# EAGLE design SmartCup (EAGLE 6.5.0)
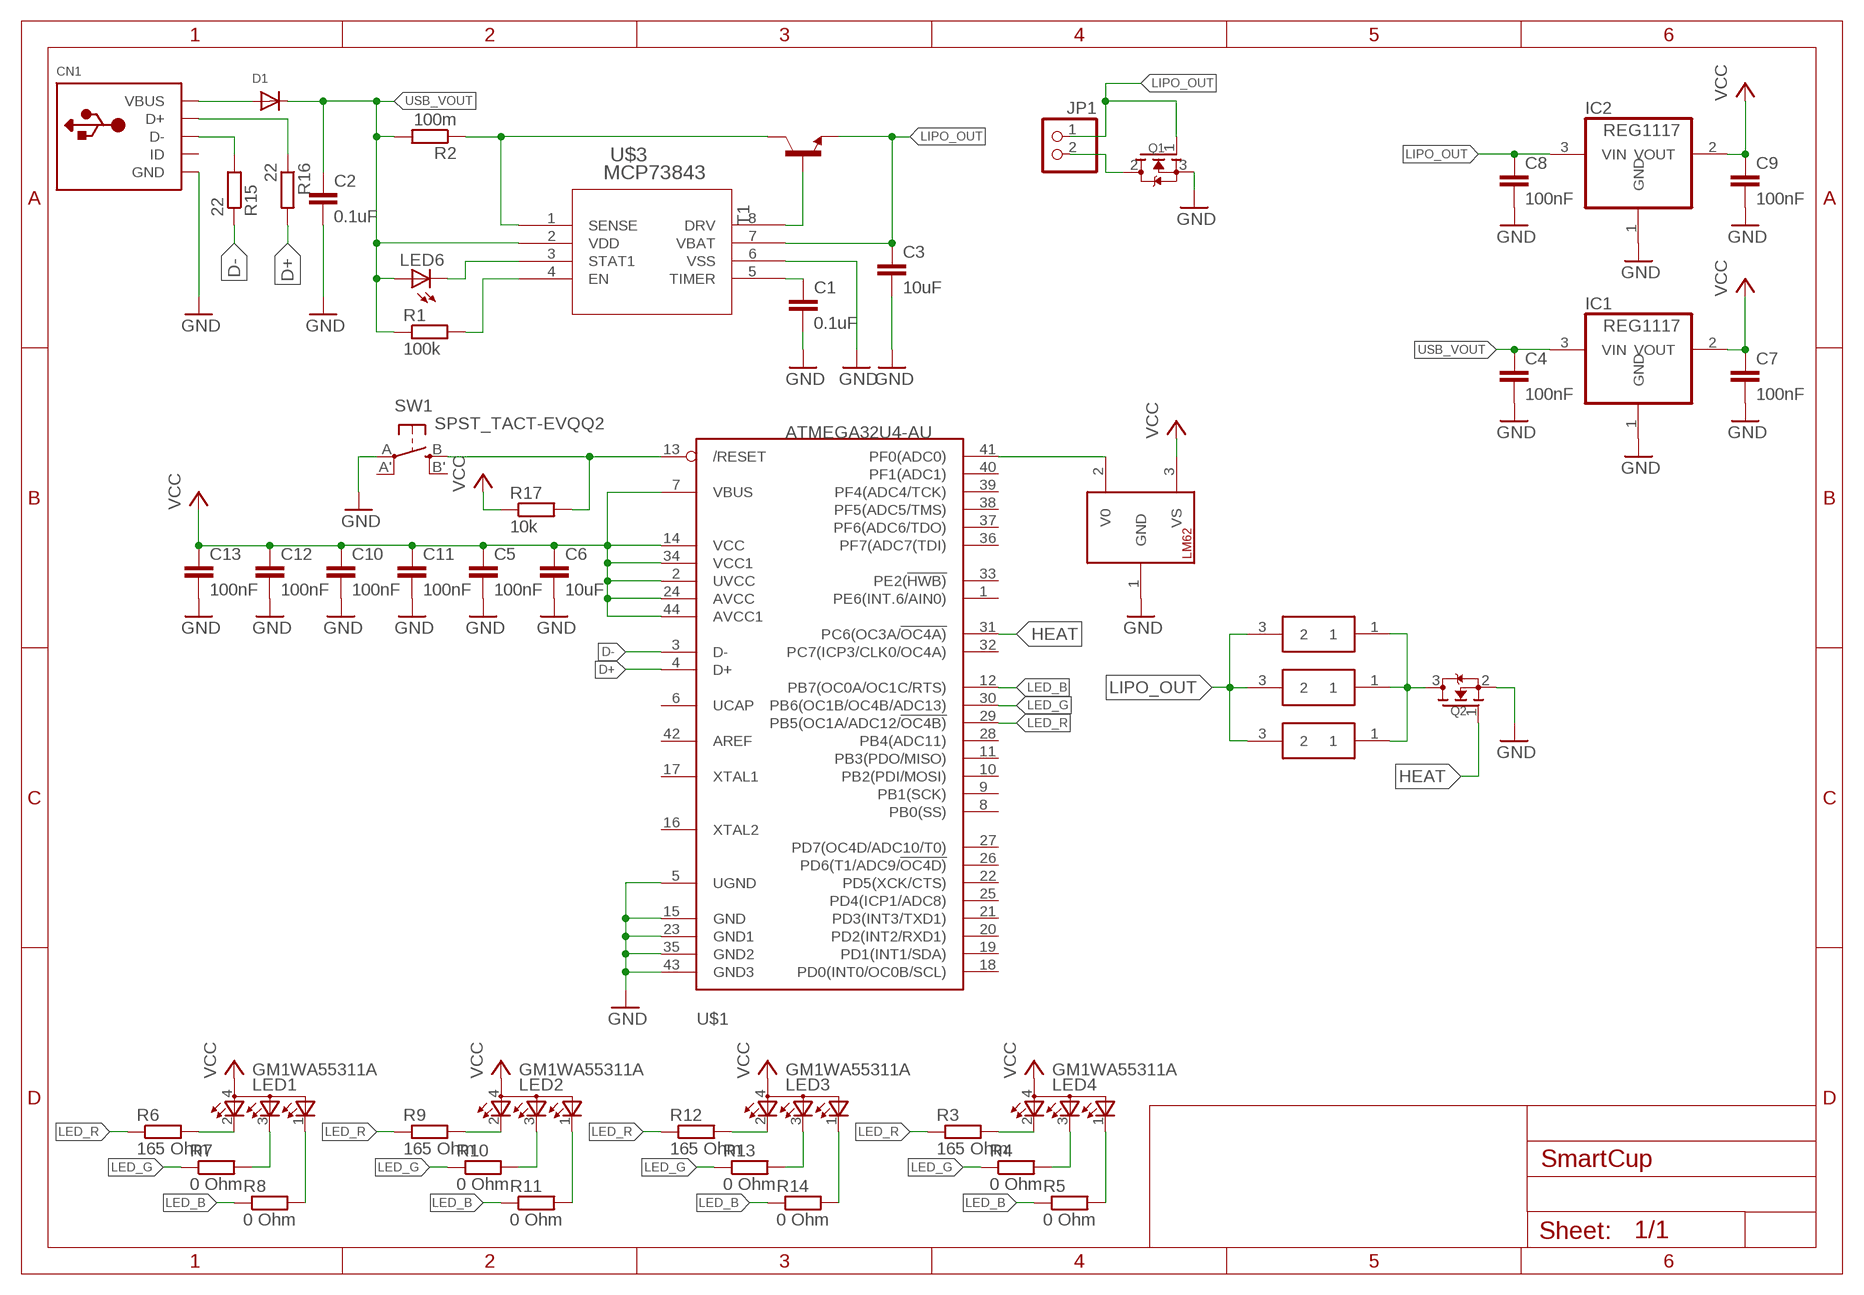
[diagram p0: schematic, sheet 1]

## Parts
C1  0.1uF  C-EUC0603  [C0603]
C2  0.1uF  C-EUC0603  [C0603]
C3  10uF  C-EUC0603  [C0603]
C4  100nF  C-EUC0603  [C0603]
C5  100nF  C-EUC0603  [C0603]
C6  10uF  C-EUC0805  [C0805]
C7  100nF  C-EUC0603  [C0603]
C8  100nF  C-EUC0603  [C0603]
C9  100nF  C-EUC0603  [C0603]
C10  100nF  C-EUC0603  [C0603]
C11  100nF  C-EUC0603  [C0603]
C12  100nF  C-EUC0603  [C0603]
C13  100nF  C-EUC0603  [C0603]
CN1  USBMINIB  [USB-MINIB]
D1  DIODE_SOD-123FL  [SOD-123FL]
IC1  REG1117  [SOT223]
IC2  REG1117  [SOT223]
JP1  PINHD-1X2  [1X02]
LED1  GM1WA55311A  [GM1WA55311A]
LED2  GM1WA55311A  [GM1WA55311A]
LED3  GM1WA55311A  [GM1WA55311A]
LED4  GM1WA55311A  [GM1WA55311A]
LED6  LEDCHIP-LED0603  [CHIP-LED0603]
Q1  MOSFET-NSOT223  [SOT223]
Q2  MOSFET-NREFLOW  [SOT23]
R1  100k  R-EU_R0603  [R0603]
R2  100m  R-EU_R0603  [R0603]
R3  165 Ohm  R-EU_R0603  [R0603]
R4  0 Ohm  R-EU_R0603  [R0603]
R5  0 Ohm  R-EU_R0603  [R0603]
R6  165 Ohm  R-EU_R0603  [R0603]
R7  0 Ohm  R-EU_R0603  [R0603]
R8  0 Ohm  R-EU_R0603  [R0603]
R9  165 Ohm  R-EU_R0603  [R0603]
R10  0 Ohm  R-EU_R0603  [R0603]
R11  0 Ohm  R-EU_R0603  [R0603]
R12  165 Ohm  R-EU_R0603  [R0603]
R13  0 Ohm  R-EU_R0603  [R0603]
R14  0 Ohm  R-EU_R0603  [R0603]
R15  22  R-EU_R0603  [R0603]
R16  22  R-EU_R0603  [R0603]
R17  10k  R-EU_R0603  [R0603]
SW1  SPST_TACT-EVQQ2  [EVQ-Q2]
T1  -NPN-SOT23-EBC  [SOT23-EBC]
U$1  ATMEGA32U4-AU  [TQFP44]
U$3  MCP73843  [MSOP8_MC]
U$4  LM62TO-92  [TO92-]
U$6  BOURNS_PWR  [DPAK]
U$7  BOURNS_PWR  [DPAK]
U$8  BOURNS_PWR  [DPAK]

## Nets
D+: R16.2 U$1.4(D+)
D-: R15.1 U$1.3(D-)
GND: C1.2 C2.2 C3.2 C4.2 C5.2 C6.2 C7.2 C8.2 C9.2 C10.2 C11.2 C12.2 C13.2 CN1.GND IC1.1(GND) IC2.1(GND) Q1.3(S) Q2.2(S) SW1.A(P) U$1.5(UGND) U$1.15(GND) U$1.23(GND1) U$1.35(GND2) U$1.43(GND3) U$3.6(VSS) U$4.1(GND)
HEAT: Q2.1(G) U$1.31(PC6(OC3A/!OC4A))
LED_B: R5.1 R8.1 R11.1 R14.1 U$1.12(PB7(OC0A/OC1C/RTS))
LED_G: R4.1 R7.1 R10.1 R13.1 U$1.30(PB6(OC1B/OC4B/ADC13))
LED_R: R3.1 R6.1 R9.1 R12.1 U$1.29(PB5(OC1A/ADC12/!OC4B))
LIPO_OUT: C3.1 C8.1 IC2.3(VIN) JP1.1 Q1.1(G) T1.E U$3.7(VBAT) U$6.3 U$7.3 U$8.3
N$2: LED6.C U$3.3(STAT1)
N$3: CN1.VBUS D1.A
N$4: R1.2 U$3.4(EN)
N$5: T1.B U$3.8(DRV)
N$6: C1.1 U$3.5(TIMER)
N$7: LED4.2(CRED) R3.2
N$8: JP1.2 Q1.2(D)
N$9: LED3.2(CRED) R12.2
N$10: LED4.3(CBLUE) R4.2
N$11: R2.1 T1.C U$3.1(SENSE)
N$12: LED4.1(CGREEN) R5.2
N$13: LED1.2(CRED) R6.2
N$14: LED1.3(CBLUE) R7.2
N$15: LED1.1(CGREEN) R8.2
N$16: LED2.2(CRED) R9.2
N$17: LED2.3(CBLUE) R10.2
N$18: LED2.1(CGREEN) R11.2
N$19: LED3.3(CBLUE) R13.2
N$21: LED3.1(CGREEN) R14.2
N$22: U$1.41(PF0(ADC0)) U$4.2(V0)
N$23: CN1.D- R15.2
N$24: CN1.D+ R16.1
N$25: R17.2 SW1.B(S) U$1.13(/RESET)
N$26: Q2.3(D) U$6.1 U$7.1 U$8.1
USB_VOUT: C2.1 C4.1 D1.C IC1.3(VIN) LED6.A R1.1 R2.2 U$3.2(VDD)
VCC: C5.1 C6.1 C7.1 C9.1 C10.1 C11.1 C12.1 C13.1 IC1.2(VOUT) IC2.2(VOUT) LED1.4(A) LED2.4(A) LED3.4(A) LED4.4(A) R17.1 U$1.2(UVCC) U$1.7(VBUS) U$1.14(VCC) U$1.24(AVCC) U$1.34(VCC1) U$1.44(AVCC1) U$4.3(VS)
Unconnected: CN1.ID SW1.A'(P1) SW1.B'(S1) U$1.1(PE6(INT.6/AIN0)) U$1.6(UCAP) U$1.8(PB0(SS)) U$1.9(PB1(SCK)) U$1.10(PB2(PDI/MOSI)) U$1.11(PB3(PDO/MISO)) U$1.16(XTAL2) U$1.17(XTAL1) U$1.18(PD0(INT0/OC0B/SCL)) U$1.19(PD1(INT1/SDA)) U$1.20(PD2(INT2/RXD1)) U$1.21(PD3(INT3/TXD1)) U$1.22(PD5(XCK/CTS)) U$1.25(PD4(ICP1/ADC8)) U$1.26(PD6(T1/ADC9/!OC4D)) U$1.27(PD7(OC4D/ADC10/T0)) U$1.28(PB4(ADC11)) U$1.32(PC7(ICP3/CLK0/OC4A)) U$1.33(PE2(!HWB)) U$1.36(PF7(ADC7(TDI)) U$1.37(PF6(ADC6/TDO)) U$1.38(PF5(ADC5/TMS)) U$1.39(PF4(ADC4/TCK)) U$1.40(PF1(ADC1)) U$1.42(AREF)

## Library data of the parts
C1-C13 = resistor:C-EU: CAPACITOR, European symbol
CN1 = adafruit:USB: USB Connectors USBMINIB - Surface Mount Female Mini-B USB Connector 4UConnector: 06564 By microbuilder.eu Thru-hole RA Female Mini-B USB Connector 4UConnector: 18732 By ladyada.net
D1 = adafruit:DIODE: Diode SMADIODE - SMA Surface Mount Package 20V 1A Schottky Diode Digikey: 641-1014-6-ND DO-1N4148 - Through Hole Small Current Diode SOD-123 20V 1 A (.5mV Vf) Schottky Diode - Digikey: MBRX120TPMSCT-ND SOD-323 10V 570mA (.38mV Vf, 3ns) Schottky Diode - Digikey: ZLLS410CT-ND SOD-523 30V 30mA Schottky Diode (RB751S-40TE61) - Digikey: RB751S-40TE61CT-ND SOT23-R/W - SOT23 Package (R = Solder Paste/Reflow Ovens, W = Hand-Soldering) BAT54Film 40V 300mA - Digikey: 497-7162-1-ND
IC1 IC2 = burr-brown:REG1117: 800mA and 1A Low Dropout (LDO) Positive Regulator 1.8V, 2.5V, 2.85V, 3.3V, 5V, and Adj; MPN: REG1117; OC_FARNELL: 1097566; OC_NEWARK: 14P6981
JP1 = pinhead:PINHD-1X2: PIN HEADER
LED1-LED4 = led:GM1WA55311A: Chip LED RGB Source: http://document.sharpsma.com/files/GM1WA55311A_SS.pdf
LED6 = adafruit:LED: LED OSRAM: - CHIPLED LG R971, LG N971, LY N971, LG Q971, LY Q971, LO R971, LY R971 LH N974, LH R974 LS Q976, LO Q976, LY Q976 LO Q996 - Hyper CHIPLED LW Q18S LB Q993, LB Q99A, LB R99A - SideLED LS A670, LO A670, LY A670, LG A670, LP A670 LB A673, LV A673, LT A673, LW A673 LH A674 LY A675 LS A676, LA A676, LO A676, LY A676, LW A676 LS A679, LY A679, LG A679 - Hyper Micro SIDELED® LS Y876, LA Y876, LO Y876, LY Y876 LT Y87S - SmartLED LW L88C, LW L88S LB L89C, LB L89S, LG L890 LS L89K, LO L89K, LY L89K LS L896, LA L896, LO L896, LY L896 - TOPLED LS T670, LO T670, LY T670, LG T670, LP T670 LSG T670, LSP T670, LSY T670, LOP T670, LYG T670 LG T671, LOG T671, LSG T671 LB T673, LV T673, LT T673, LW T673 LH T674 LS T676, LA T676, LO T676, LY T676, LB T676, LH T676, LSB T676, LW T676 LB T67C, LV T67C, LT T67C, LS T67K, LO T67K, LY T67K, LW E67C LS E67B, LA E67B, LO E67B, LY E67B, LB E67C, LV E67C, LT E67C LW T67C LS T679, LY T679, LG T679 LS T770, LO T770, LY T770, LG T770, LP T770 LB T773, LV T773, LT T773, LW T773 LH T774 LS E675, LA E675, LY E675, LS T675 LS T776, LA T776, LO T776, LY T776, LB T776 LHGB T686 LT T68C, LB T68C - Hyper Mini TOPLED® LB M676 - Mini TOPLED Santana® LG M470 LS M47K, LO M47K, LY M47K Source: http://www.osram.convergy.de/
Q1 Q2 = adafruit:MOSFET-N: N-Channel Mosfet 2N7002E - 60V 260mA SOT23 [Digikey: 2N7002ET1GOSTR-ND] - REEL BSH103 - 30V 850mA SOT23 [Digikey: 568-5013-1-ND]
R1-R17 = resistor:R-EU_: RESISTOR, European symbol
SW1 = adafruit:SPST_TACT: SMT 6mm switch, EVQQ2 series http://www.ladyada.net/library/eagle
T1 = transistor:*-NPN-: NPN Transistror BF959 corrected 2008.03.06
U$1 = adafruit:ATMEGA32U4: http://www.ladyada.net/library/eagle
U$3 = MCP73843:MCP73843
U$4 = LM62:LM62
U$6-U$8 = BOURNS:BOURNS_PWR

## Board
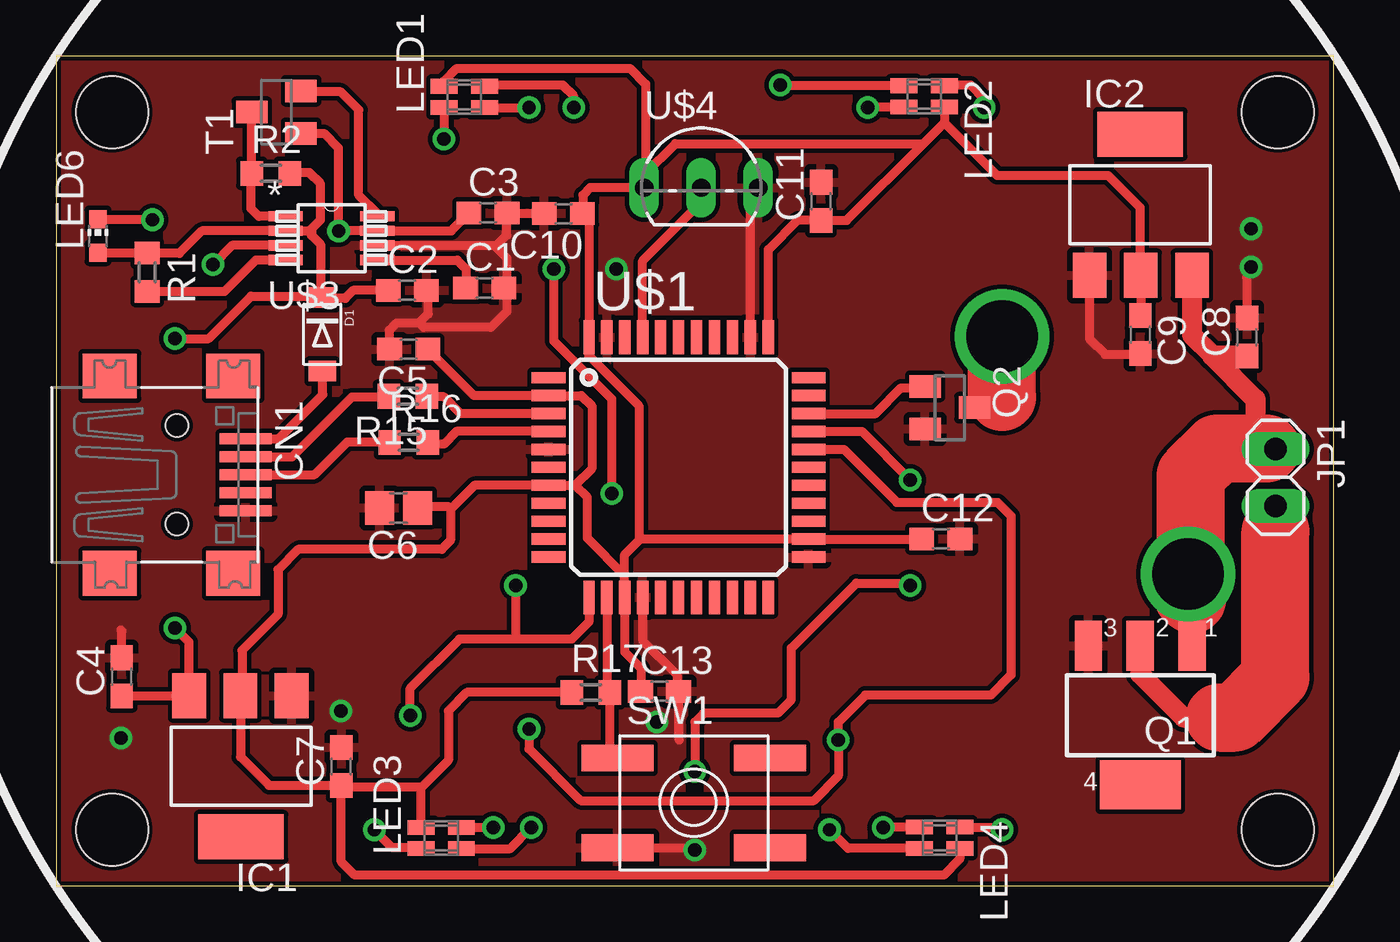
[diagram p1: board, top side]
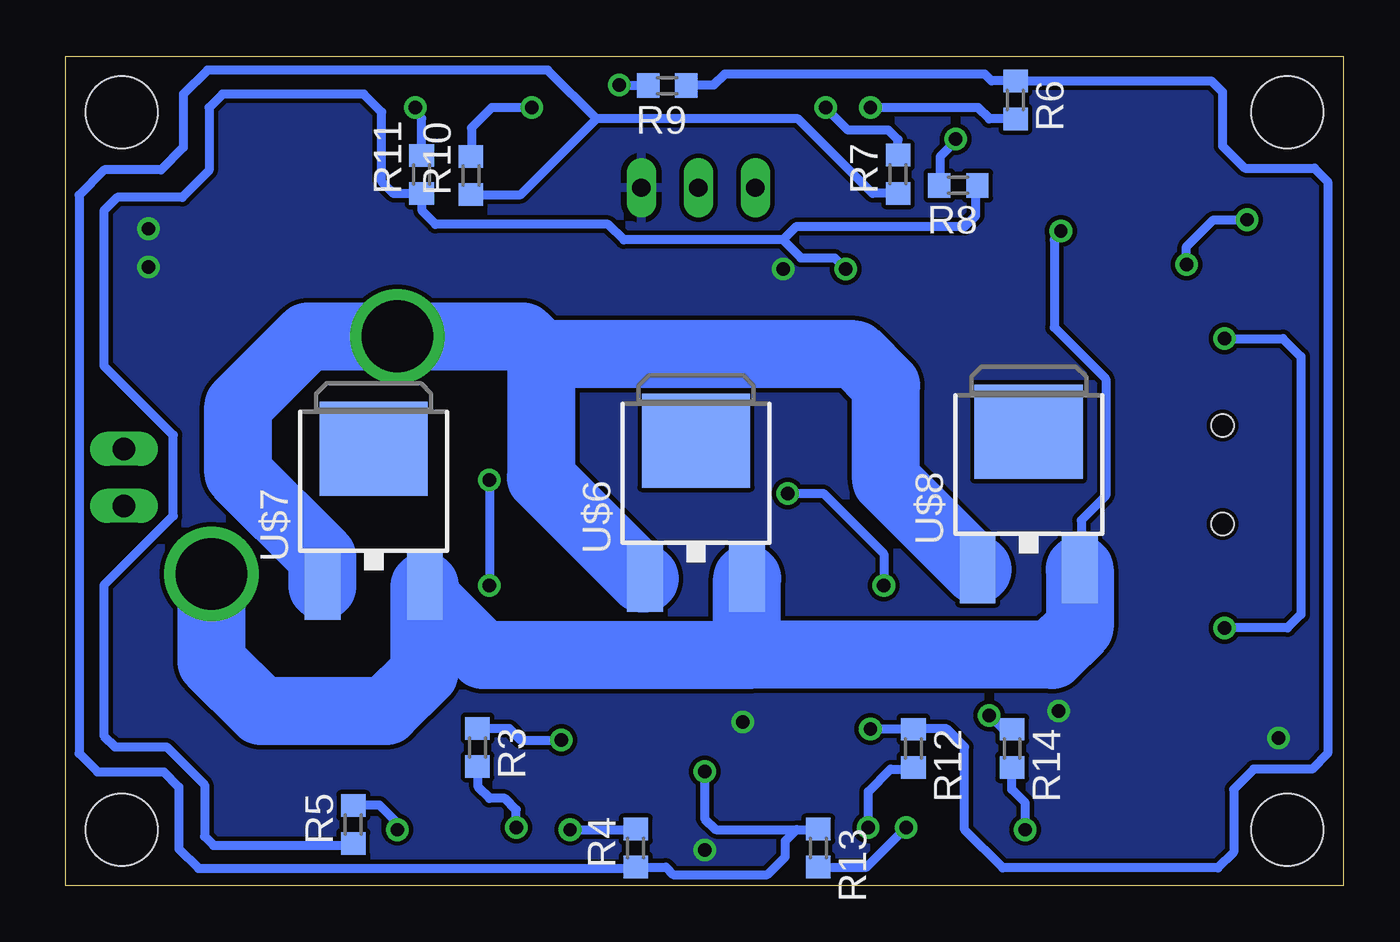
[diagram p2: board, bottom side, seen from below]

Size 57 x 37 mm. Coordinates in mm from the lower left corner, seen from the top.
Outline: 0,0 57,0 57,37 0,37 0,0
Copper layers (1*16): Top 0.035mm / dielectric 1.5mm / Bottom 0.035mm
Design rules "default *": minimum track width 0.2mm, minimum drill 0.3mm, track to track 0.2mm, track to pad 0.2mm, pad to pad 0.2mm, via to via 0.2mm, smd to smd 0mil, copper to edge 0.2mm, drill to drill 0.2mm, minimum pad ring 10mil, minimum via ring 8mil, stop-mask expansion 4mil, vias tented up to drill 0mil, thermal gap 10mil
Holes 3.2 mm at 2.5,2.5 54.5,2.5 54.5,34.5 2.5,34.5

### Footprints (pad centres in the part's own frame; a part is rotated, then mirrored left to right if it is on the bottom)
C0603 = smd 1.1 x 1: 1 -0.85,0; 2 0.85,0
C0805 = smd 1.3 x 1.5: 1 -0.85,0; 2 0.85,0
USB-MINIB = smd 0.5 x 2.308: D+ 0,4.064; D- -0.8,4.064; GND 1.6,4.064; ID 0.8,4.064; VBUS -1.6,4.064 | smd 2 x 2.4: GND1 -4.4,-2; GND2 -4.4,3.5; GND3 4.4,3.5; GND4 4.4,-2 | hole 1: -2.2,1; 2.2,1
SOD-123FL = smd 0.91 x 1.22: A 1.637,0; C -1.637,0
SOT223 = smd 1.499 x 2.007: 1 -2.261,-3.15; 2 0.025,-3.15; 3 2.311,-3.15 | smd 3.81 x 2.007: 4 0,3.15
1X02 = drill 1.016 long: 1 -1.27,0; 2 1.27,0
GM1WA55311A = smd 0.65 x 1.2: 1 -0.475,0.9; 2 -0.475,-0.9; 3 0.475,-0.9; 4 0.475,0.9
CHIP-LED0603 = smd 0.8 x 0.8: A 0,-0.75; C 0,0.75
SOT223' = smd 1.219 x 2.235: 1 -2.311,-3.099; 2 0,-3.099; 3 2.311,-3.099 | smd 3.6 x 2.2: 4 0,3.099
SOT23 = smd 1 x 1.4: 1 -0.95,-1.1; 2 0.95,-1.1; 3 0,1.1
R0603 = smd 1 x 1.1: 1 -0.85,0; 2 0.85,0
EVQ-Q2 = smd 3.2 x 1.2: A -3.4,-2; A' 3.4,-2; B -3.4,2; B' 3.4,2
SOT23-EBC = smd 1 x 1.4: B 0.95,-1.1; C 0,1.1; E -0.95,-1.1
TQFP44 = smd 1.5 x 0.5: 1 -5.8,4; 2 -5.8,3.2; 3 -5.8,2.4; 4 -5.8,1.6; 5 -5.8,0.8; 6 -5.8,0; 7 -5.8,-0.8; 8 -5.8,-1.6; 9 -5.8,-2.4; 10 -5.8,-3.2; 11 -5.8,-4; 23 5.8,-4; 24 5.8,-3.2; 25 5.8,-2.4; 26 5.8,-1.6; 27 5.8,-0.8; 28 5.8,0; 29 5.8,0.8; 30 5.8,1.6; 31 5.8,2.4; 32 5.8,3.2; 33 5.8,4 | smd 0.5 x 1.5: 12 -4,-5.8; 13 -3.2,-5.8; 14 -2.4,-5.8; 15 -1.6,-5.8; 16 -0.8,-5.8; 17 0,-5.8; 18 0.8,-5.8; 19 1.6,-5.8; 20 2.4,-5.8; 21 3.2,-5.8; 22 4,-5.8; 34 4,5.8; 35 3.2,5.8; 36 2.4,5.8; 37 1.6,5.8; 38 0.8,5.8; 39 0,5.8; 40 -0.8,5.8; 41 -1.6,5.8; 42 -2.4,5.8; 43 -3.2,5.8; 44 -4,5.8
MSOP8_MC = smd 1.524 x 0.457: 1 -2.045,0.975; 2 -2.045,0.325; 3 -2.045,-0.325; 4 -2.045,-0.975; 5 2.045,-0.975; 6 2.045,-0.325; 7 2.045,0.325; 8 2.045,0.975
TO92- = drill 0.813 long: 1 2.54,-1.27; 2 0,-1.27; 3 -2.54,-1.27
DPAK = smd 1.6 x 3: 1 -2.28,-4.04; 3 2.28,-4.04 | smd 4.826 x 4.191: 4 0,2.096

### Placement (x,y rotation side)
C1  19.12,26.65 0 top
C2  15.67,26.55 0 top
C3  19.27,30 0 top
C4  2.93,9.32 90 top
C5  15.73,23.93 180 top
C6  15.28,16.85 180 top
C7  12.73,5.32 90 top
C8  53.13,24.47 90 top
C9  48.37,24.58 270 top
C10  22.63,29.98 180 top
C11  34.13,30.52 90 top
C12  39.47,15.47 0 top
C13  26.92,8.67 0 top
CN1  4.4,18.33 270 top
D1  11.88,24.59 270 top
IC1  8.25,5.33 180 top
IC2  48.36,30.37 0 top
JP1  54.4,18.21 270 top
LED1  18.21,35.18 90 top
LED2  38.72,35.2 270 top
LED3  17.18,2.13 90 top
LED4  39.42,2.14 270 top
LED6  1.87,28.98 0 top
Q1  [SOT223']  48.37,7.61 180 top
Q2  39.87,21.32 270 top
R1  4.07,27.36 270 top
R2  9.58,31.77 0 top
R3  38.63,6.17 270 bottom
R4  31.57,1.68 90 bottom
R5  44.17,2.73 90 bottom
R6  14.63,35.05 270 bottom
R7  19.87,31.73 90 bottom
R8  17.18,31.23 180 bottom
R9  30.17,35.68 180 bottom
R10  38.92,31.67 90 bottom
R11  41.12,31.72 90 bottom
R12  19.18,6.13 270 bottom
R13  23.43,1.68 270 bottom
R14  14.78,6.13 270 bottom
R15  15.69,21.83 180 top
R16  15.73,19.77 0 top
R17  23.85,8.62 0 top
SW1  28.45,3.7 0 top
T1  9.83,34.5 90 top
U$1  27.77,18.66 0 top
U$3  12.29,28.88 0 top
U$4  28.78,32.4 0 top
U$6  28.88,17.75 0 bottom
U$7  43.26,17.4 0 bottom
U$8  14.04,18.15 0 bottom

### Tracks (layer width: path | path; a pad name or v marks a point on that pad's centre or on a via)
D+
  Top 0.406: U$1.4 17.86,20.26 17.3,19.7 16.65,19.7 R16.2
D-
  Top 0.406: U$1.3 18.04,21.06 17.3,21.8 16.57,21.8 R15.1
GND  (via drill 0.6)
  Top 0.406: IC2.1 46.1,24.4 46.8,23.7 48.34,23.7 C9.2 | U$1.35 30.97,30.78 U$4.1 | C5.2 14.88,24.78 15.2,25.1 16.2,25.1 | C10.2 21.76,30 C3.2 20.1,29.98 20.1,29 19.66,28.55 | U$3.6 19.66,28.55 | 19.66,28.55 19.66,28.45 20.1,28 20.1,26.78 | 20.1,26.78 C1.2 | U$1.15 26.17,10.93 27.7,9.4 27.7,8.74 C13.2 27.8,8.64 27.8,6.5 | C8.2 53.13,27.07 53.1,27.1 | SW1.A 28.4,1.7 | C4.2 2.93,11.37 2.9,11.4 | 16.2,25.1 16.6,25.5 16.6,26.47 C2.2 | 20.1,26.78 20.1,25.6 19.4,24.9 16.4,24.9 16.2,25.1 | IC1.1
  other vias: 53.3,29.3 53.3,27.6 2.9,6.6 12.7,7.8 25,27.5 28.5,1.6 26.8,7.3
  pour Bottom: 0,0 57,0 57,37 0,37
  pour Top: 0,0 57,0 57,37 0,37
HEAT
  Top 0.406: U$1.31 36.56,21.06 37.7,22.2 38.7,22.2 Q2.1
LED_B  (via drill 0.6)
  Top 0.406: v22.2,27.5 22.2,24.3 24.8,21.7 v24.8,17.5 | 23.8,12.89 U$1.12 23.77,11.77 23,11 20.5,11 | v15.8,7.6 15.8,8.8 18,11 20.5,11 | v20.5,13.4 20.5,11
  Bottom 0.406: 14.98,6.98 R14.1 15.18,6.98 v15.8,7.6 | R5.1 44.25,1.8 50.4,1.8 50.8,2.2 50.8,4.5 52.5,6.2 54.8,6.2 55.3,6.7 55.3,13.4 52.2,16.5 52.2,20.1 55.3,23.2 55.3,30.1 54.7,30.7 51.8,30.7 50.6,31.9 50.6,34.7 50,35.3 43.7,35.3 42.9,34.5 42.9,31.4 42.37,30.87 R11.1 41.1,30.85 41.1,30.1 40.5,29.5 32.8,29.5 32.1,28.8 25,28.8 | 25,28.8 24.4,29.4 16.9,29.4 16.4,29.9 16.4,31.16 R8.1 | 25,28.8 24.2,28 22.7,28 v22.2,27.5 | v24.8,17.5 23.2,17.5 20.5,14.8 v20.5,13.4
LED_G  (via drill 0.6)
  Top 0.406: v28.5,5.1 28.5,7.3 28.9,7.7 32.2,7.7 32.8,8.3 32.8,10.6 35.7,13.5 38,13.5 v38.1,13.4 | U$1.30 35.94,20.26 v38.1,18.1
  Bottom 0.406: R7.1 21,30.88 24.32,34.2 33.33,34.2 | 33.33,34.2 35.5,36.38 50.67,36.38 51.75,35.3 51.75,32.92 52.75,31.93 55.27,31.93 56.4,30.8 56.4,5.9 55.58,5.08 52.62,5.08 51.95,4.4 51.95,1.65 51.08,0.78 31.62,0.78 R4.1 30.23,0.83 29.9,0.5 25.7,0.5 24.9,1.3 24.9,2 24.4,2.5 | R10.1 36.7,30.82 33.33,34.2 | 24.4,2.5 23.46,2.5 R13.1 | v28.5,5.1 28.5,3 28,2.5 24.4,2.5 | v38.1,18.1 v38.1,13.4
LED_R  (via drill 0.6)
  Top 0.406: v21.1,7 21.1,6.1 23.4,3.8 33.8,3.8 34.9,4.9 v34.9,6.5 34.9,7.3 36.1,8.5 41.7,8.5 42.6,9.4 42.6,16.5 42,17.1 37.5,17.1 35.14,19.46 U$1.29
  Bottom 0.406: v21.1,7 21.08,6.98 R12.1 19.16,7 17.7,7 16.9,6.2 16.9,2.5 15.2,0.8 5.6,0.8 4.9,1.5 4.9,4.3 4,5.2 1.4,5.2 0.7,5.9 0.7,31.4 1.3,32 4.4,32 5.4,33 5.4,35.4 5.89,35.9 R6.1 15.7,35.9 16,36.2 27.6,36.2 28.1,35.7 29.3,35.7 R9.1 | 38.6,7.05 R3.1 37.22,7.02 36.7,6.5 v34.9,6.5
LIPO_OUT  (via drill 0.6, 3.2)
  Top 0.406: T1.E 11.95,33.55 12.6,32.9 v12.6,29.2 v12.61,29.2 U$3.7 17.62,29.2 C3.1
  Top 0.9: IC2.3 50.67,24.55 51.58,23.65 | 51.58,23.65 53.1,23.65 C8.1 53.15,23.6 | Q1.1 50.68,12.78 50.7,12.8 | JP1.1 54.02,19.48 54,19.5 | 51.58,23.65 51.58,23.62 53.5,21.7 53.5,19.7 53.3,19.5
  Top 3.03: 54,19.5 53.3,19.5 51.8,19.5 50.6,18.3 50.6,12.85 | 50.6,12.85 50.68,12.78 | 50.6,12.85 50.55,12.85 50.5,12.9 v50.5,13.9
  Bottom 0.406: U$8.3 11.7,14.17 11.7,16.3 10.6,17.4 10.6,22.6 12.9,24.9 12.9,28.8 12.61,29.09 v12.61,29.2
  Bottom 3.03: U$8.3 11.76,11.54 13,10.3 26.5,10.3 26.6,10.4 | 26.6,10.4 U$6.3 | 26.6,10.4 26.7,10.3 38.4,10.3 40.98,12.88 U$7.3 41,13.34 41,9.5 42.7,7.8 48.3,7.8 50.5,10 v50.5,13.9
N$2  (via drill 0.6)
  Top 0.406: U$3.3 7.86,28.55 v7,27.7 | v4.3,29.7 1.9,29.7 LED6.C
  Bottom 0.406: v7,27.7 7,28.5 5.8,29.7 v4.3,29.7
N$3
  Top 0.406: CN1.VBUS 9.93,19.93 11.9,21.9 11.9,22.93 D1.A
N$4
  Top 0.406: U$3.4 8.9,27.91 7.5,26.5 R1.2
N$5
  Top 0.406: U$3.8 14.34,29.96 13.5,30.8 13.5,34.6 12.7,35.4 10.98,35.4 T1.B
N$6
  Top 0.406: U$3.5 17.89,27.91 18.3,27.5 18.3,26.68 C1.1
N$7  (via drill 0.6)
  Top 0.406: LED4.2 36.91,2.62 v36.9,2.6
  Bottom 0.406: v36.9,2.6 36.9,3.4 37.4,3.9 38.1,3.9 38.6,4.4 38.6,5.29 R3.2
N$8
  Top 0.9: JP1.2 54.4,15.8 | Q1.2 48.37,9.44 50.3,7.5 51.9,7.5
  Top 3.03: 51.9,7.5 52.6,7.5 54.4,9.3 54.4,15.8
N$9  (via drill 0.6)
  Top 0.406: LED3.2 20.25,1.66 v21.2,2.6
  Bottom 0.406: v21.2,2.6 21.2,4.2 20.2,5.2 19.26,5.2 R12.2
N$10  (via drill 0.6)
  Top 0.406: LED4.3 35.34,1.67 v34.5,2.5
  Bottom 0.406: v34.5,2.5 31.6,2.5 R4.2
N$11
  Top 0.406: U$3.1 9.04,29.86 8.7,30.2 8.7,31.74 R2.1 T1.C
N$12  (via drill 0.6)
  Top 0.406: LED4.1 42.09,2.62 v42.2,2.5
  Bottom 0.406: v42.2,2.5 42.2,2.8 43,3.6 44.15,3.6 R5.2
N$13  (via drill 0.6)
  Top 0.406: LED1.2 v21.09,34.7 v21.1,34.7
  Bottom 0.406: R6.2 15.79,34.2 16.3,34.7 v21.1,34.7
N$14  (via drill 0.6)
  Top 0.406: v23.1,34.7 23.1,35.2 22.6,35.7 19.16,35.7 LED1.3
  Bottom 0.406: R7.2 19.87,33.27 20.3,33.7 22.1,33.7 v23.1,34.7
N$15  (via drill 0.6)
  Top 0.406: LED1.1 v17.3,33.3
  Bottom 0.406: v17.3,33.3 17.3,33.2 18,32.5 18,31.26 R8.2
N$16  (via drill 0.6)
  Top 0.406: v32.3,35.7 37.8,35.7 LED2.2
  Bottom 0.406: v32.3,35.7 31.04,35.7 R9.2
N$17  (via drill 0.6)
  Top 0.406: LED2.3 36.23,34.73 v36.2,34.7
  Bottom 0.406: v36.2,34.7 38,34.7 38.9,33.8 38.9,32.54 R10.2
N$18  (via drill 0.6)
  Top 0.406: v41.4,34.7 41.4,35.1 40.8,35.7 39.65,35.7 LED2.1
  Bottom 0.406: R11.2 41.12,34.22 41.4,34.5 v41.4,34.7
N$19  (via drill 0.6)
  Top 0.406: LED3.3 v19.5,2.6
  Bottom 0.406: R13.2 21.27,0.83 v19.5,2.6
N$21  (via drill 0.6)
  Top 0.406: LED3.1 16.23,1.7 15,1.7 v14.2,2.5
  Bottom 0.406: v14.2,2.5 14.2,3.7 14.8,4.3 14.8,5.26 R14.2
N$22
  Top 0.406: U$1.41 26.17,27.87 28.8,30.5 28.8,31.11 U$4.2
N$23
  Top 0.406: CN1.D- 10.53,19.13 13.2,21.8 14.81,21.8 R15.2
N$24
  Top 0.406: CN1.D+ 11.53,18.33 13,19.8 14.85,19.8 R16.1
N$25
  Top 0.406: U$1.13 24.57,8.75 R17.2 24.7,6.05 SW1.B
N$26  (via drill 3.2)
  Top 0.9: Q2.3 41.72,21.32 42.2,21.8
  Top 3.03: 42.2,21.8 v42.2,24.5
  Bottom 3.03: U$6.1 31.31,13.71 35.8,18.2 35.8,23.7 | U$8.1 16.41,14.11 20.4,18.1 20.4,22.3 21.8,23.7 35.8,23.7 | 35.8,23.7 36.6,24.5 v42.2,24.5 46.2,24.5 49.3,21.4 49.3,18.4 45.54,14.64 U$7.1
USB_VOUT  (via drill 0.6)
  Top 0.406: U$3.2 11.39,29.2 11.39,29 11.8,28.6 11.8,26.31 D1.C | LED6.A 1.89,28.21 R1.1 5.5,28.2 6.5,29.2 U$3.2 | U$3.2 11.3,29.2 11.8,29.7 11.8,31.3 11.3,31.8 10.46,31.8 R2.2 | C2.1 13.25,26.55 12.9,26.2 11.91,26.2 D1.C | C4.1 IC1.3 5.94,10.86 v5.3,11.5 | v5.3,24.4 6.8,24.4 8.7,26.3 11.81,26.3 D1.C
  Bottom 0.406: v5.3,24.4 2.7,24.4 1.9,23.6 1.9,12.1 2.5,11.5 v5.3,11.5
VCC
  Top 0.406: C7.1 9.5,4.47 8.22,5.75 IC1.2 8.3,8.55 8.3,10.5 9.9,12.1 9.9,14.1 10.8,15 17.2,15 17.6,15.4 17.6,16.8 | LED4.4 40.32,1.2 39.6,0.47 13.32,0.47 12.72,1.07 C7.1 | LED2.4 39.62,34.03 | 39.62,34.03 41.98,31.68 46.92,31.68 48.35,30.25 48.35,27.26 IC2.2 48.38,25.45 C9.1 | LED1.4 17.31,35.88 17.88,36.45 25.6,36.45 26.3,35.75 26.3,31.19 U$4.3 | U$4.3 26.24,31.71 27.62,33.1 38.69,33.1 | 38.69,33.1 39.62,34.03 | C5.1 18.65,21.86 U$1.2 23.44,21.86 23.9,21.4 23.9,18.6 23.16,17.86 | 16.2,17.4 16.2,16.92 | 16.2,16.92 C6.1 | C13.1 26.1,8.7 26.1,9.7 25.37,10.43 U$1.14 25.37,13.83 | U$1.34 31.77,28.37 33.1,29.7 34.1,29.7 C11.1 35.26,29.67 38.69,33.1 | R17.1 18.32,8.62 17.5,7.8 17.5,5.6 16.3,4.4 | 16.3,4.4 12.8,4.4 C7.1 | LED3.4 16.28,4.38 16.3,4.4 | U$4.3 23.83,31.13 23.5,30.8 23.5,30 C10.1 23.77,29.69 U$1.44 23.77,23.63 26,21.4 26,15.4 | 23.16,17.86 U$1.7 18.66,17.86 17.6,16.8 | 25.37,13.83 23.7,15.5 23.7,17.32 23.16,17.86 | 16.2,16.92 17.48,16.92 17.6,16.8 | 25.37,13.83 25.37,14.77 26,15.4 | C12.1 U$1.24 26.06,15.46 26,15.4